# EAGLE design 3MIC_ximpedanceREVB (EAGLE 7.7.0)

## Sheet 1 of 2
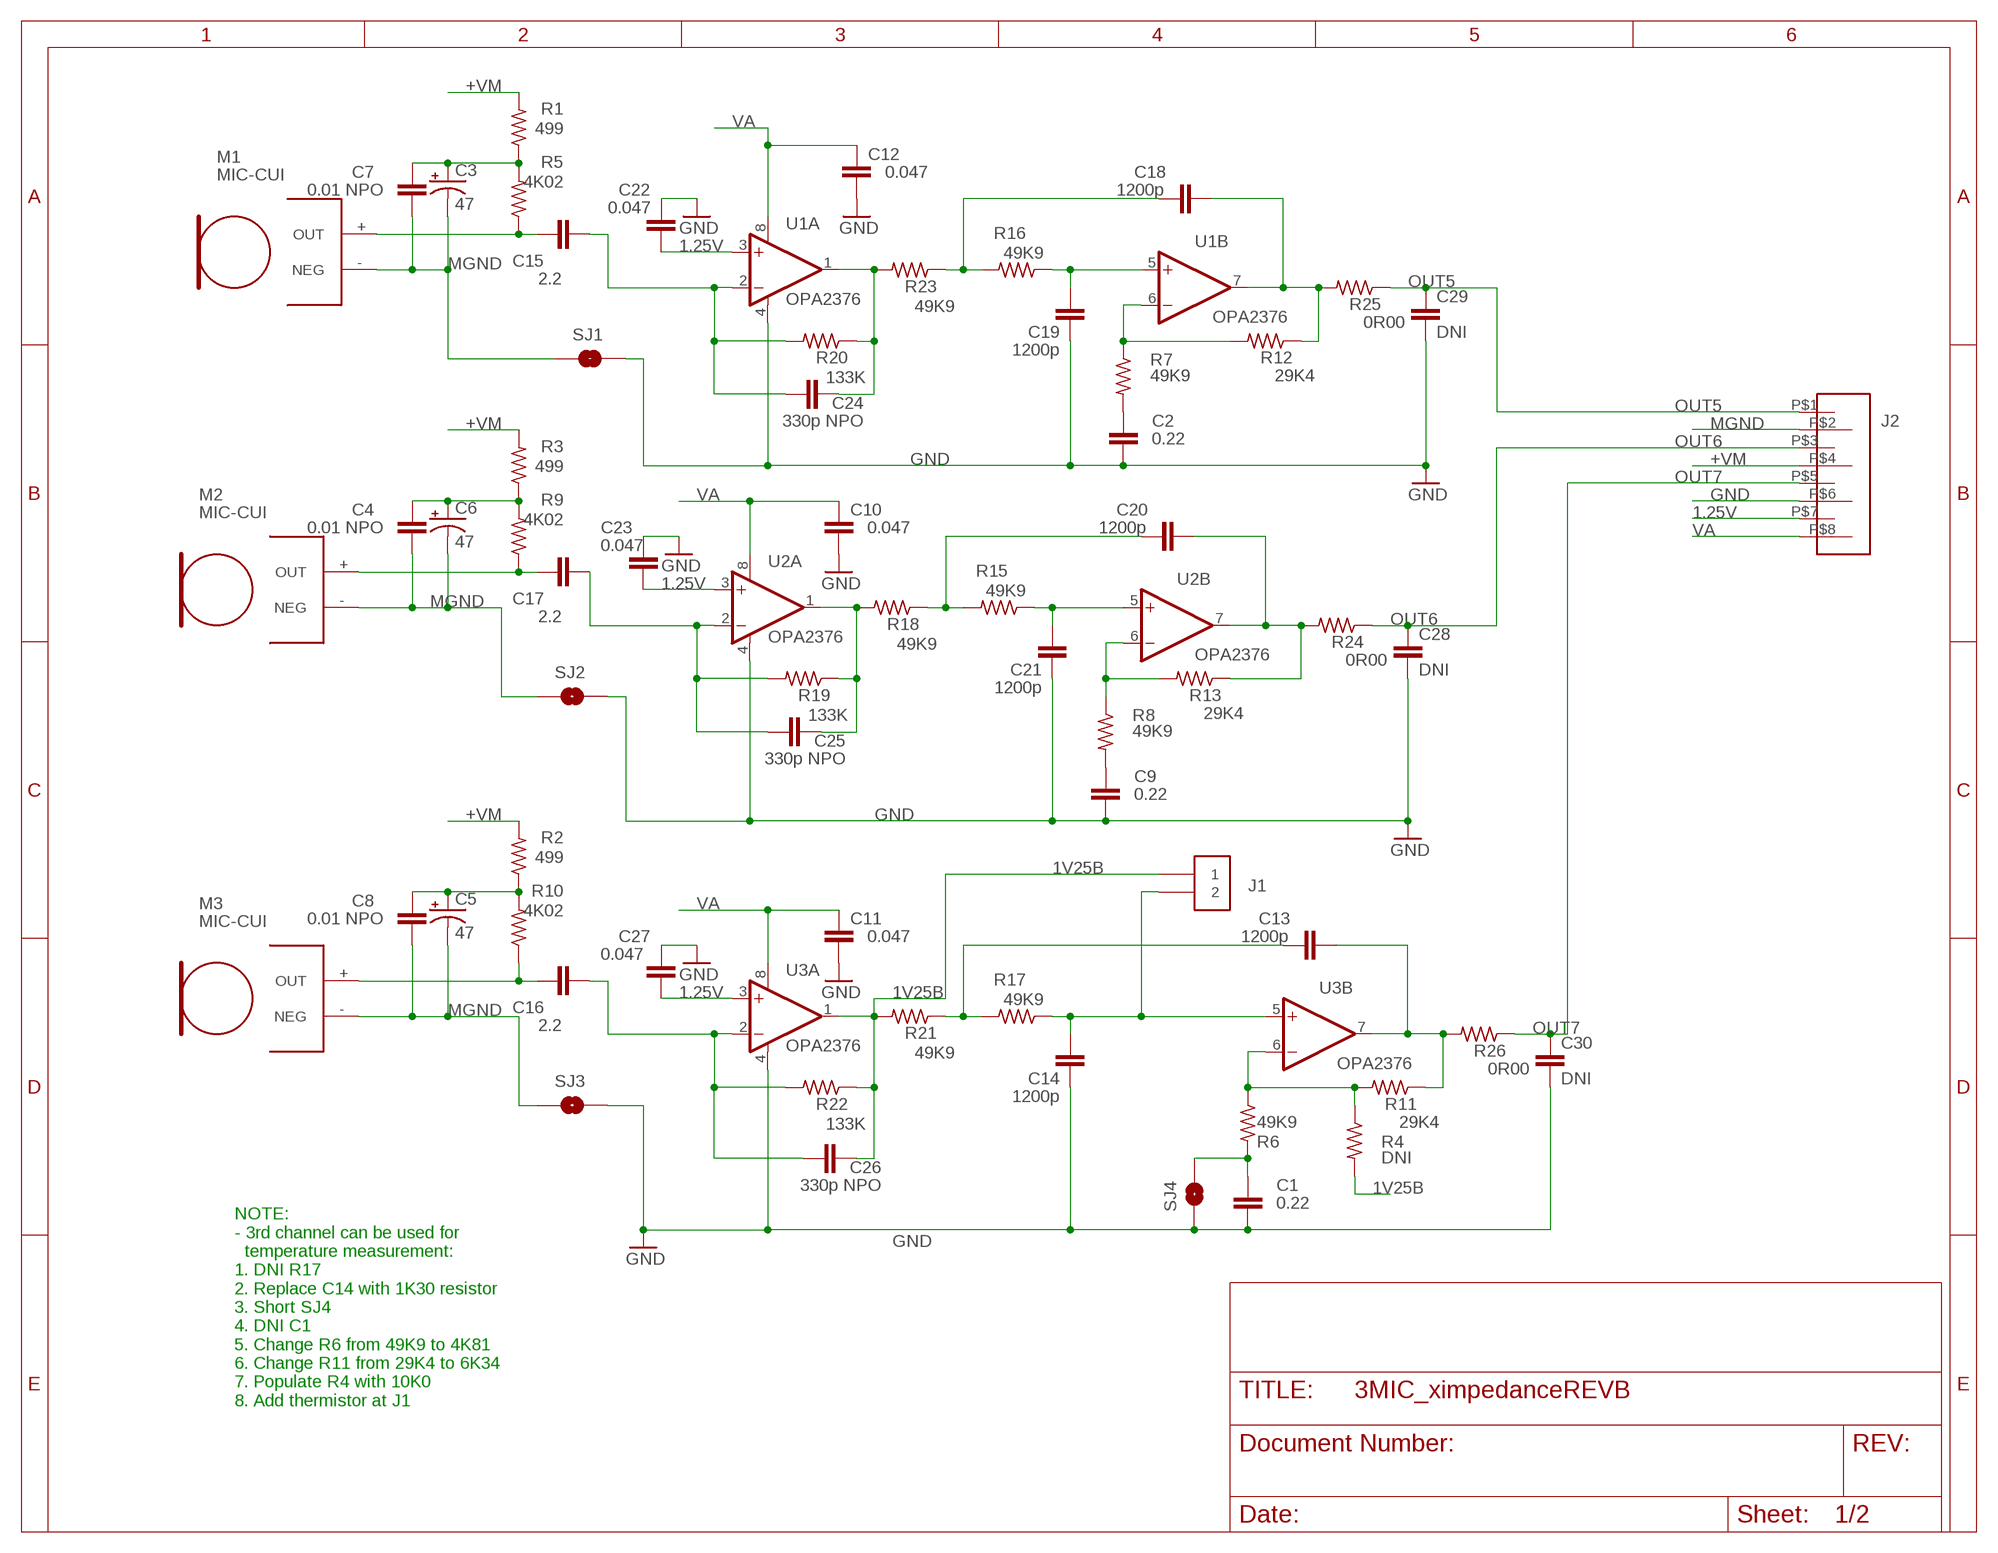
[diagram p0: schematic, sheet 1]

### Parts
C1  0.22  CAPS1206S  [1206S]
C2  0.22  CAPS1206S  [1206S]
C3  47  CAP_POL1206  [EIA3216]
C4  0.01 NPO  CAPS0603S  [0603S]
C5  47  CAP_POL1206  [EIA3216]
C6  47  CAP_POL1206  [EIA3216]
C7  0.01 NPO  CAPS0603S  [0603S]
C8  0.01 NPO  CAPS0603S  [0603S]
C9  0.22  CAPS1206S  [1206S]
C10  0.047  CAPS0805S  [0805S]
C11  0.047  CAPS0805S  [0805S]
C12  0.047  CAPS0805S  [0805S]
C13  1200p  CAPS1206S  [1206S]
C14  1200p  CAPS1206S  [1206S]
C15  2.2  CAPS1210S  [1210S]
C16  2.2  CAPS1210S  [1210S]
C17  2.2  CAPS1210S  [1210S]
C18  1200p  CAPS1206S  [1206S]
C19  1200p  CAPS1206S  [1206S]
C20  1200p  CAPS1206S  [1206S]
C21  1200p  CAPS1206S  [1206S]
C22  0.047  CAPS0805S  [0805S]
C23  0.047  CAPS0805S  [0805S]
C24  330p NPO  CAPS0805S  [0805S]
C25  330p NPO  CAPS0805S  [0805S]
C26  330p NPO  CAPS0805S  [0805S]
C27  0.047  CAPS0805S  [0805S]
C28  DNI  CAPS0603S  [0603S]
C29  DNI  CAPS0603S  [0603S]
C30  DNI  CAPS0603S  [0603S]
J1  CON2TIP-BOT-PADS  [TOP-BOT-PADS]
J2  CON8  [CON8-EDGE]
M1  MIC-CUI  [CUI_EDGE]
M2  MIC-CUI  [CUI_EDGE]
M3  MIC-CUI  [CUI_EDGE]
R1  499  RESISTOR_SM0603S  [0603S]
R2  499  RESISTOR_SM0603S  [0603S]
R3  499  RESISTOR_SM0603S  [0603S]
R4  DNI  RESISTOR_SM0603S  [0603S]
R5  4K02  RESISTOR_SM0603S  [0603S]
R6  49K9  RESISTOR_SM0603S  [0603S]
R7  49K9  RESISTOR_SM0603S  [0603S]
R8  49K9  RESISTOR_SM0603S  [0603S]
R9  4K02  RESISTOR_SM0603S  [0603S]
R10  4K02  RESISTOR_SM0603S  [0603S]
R11  29K4  RESISTOR_SM0603S  [0603S]
R12  29K4  RESISTOR_SM0603S  [0603S]
R13  29K4  RESISTOR_SM0603S  [0603S]
R15  49K9  RESISTOR_SM0603S  [0603S]
R16  49K9  RESISTOR_SM0603S  [0603S]
R17  49K9  RESISTOR_SM0603S  [0603S]
R18  49K9  RESISTOR_SM0603S  [0603S]
R19  133K  RESISTOR_SM0603S  [0603S]
R20  133K  RESISTOR_SM0603S  [0603S]
R21  49K9  RESISTOR_SM0603S  [0603S]
R22  133K  RESISTOR_SM0603S  [0603S]
R23  49K9  RESISTOR_SM0603S  [0603S]
R24  0R00  RESISTOR_SM0603S  [0603S]
R25  0R00  RESISTOR_SM0603S  [0603S]
R26  0R00  RESISTOR_SM0603S  [0603S]
SJ1  SOLDERJUMPERTRACE  [SJ_2S-TRACE]
SJ2  SOLDERJUMPERTRACE  [SJ_2S-TRACE]
SJ3  SOLDERJUMPERTRACE  [SJ_2S-TRACE]
SJ4  SOLDERJUMPERNO  [SJ_2S-NO]
U1  OPA2376  OPA2237E  [MSOP08]
U2  OPA2376  OPA2237E  [MSOP08]
U3  OPA2376  OPA2237E  [MSOP08]

### Nets
1.25V: C22.2 C23.2 C27.2 J2.P$7 U1.3(A:+IN) U2.3(A:+IN) U3.3(A:+IN)
1V25B: C26.1 J1.1 R4.2 R21.2 R22.1 U3.1(A:OUT)
+VM: J2.P$4 R1.2 R2.2 R3.2
GND: C1.1 C2.1 C9.1 C10.1 C11.1 C12.1 C14.1 C19.1 C21.1 C22.1 C23.1 C27.1 C28.2 C29.2 C30.2 J2.P$6 SJ1.2 SJ2.2 SJ3.2 SJ4.1 U1.4(A:V-) U2.4(A:V-) U3.4(A:V-)
M5: C18.1 R12.1 R25.2 U1.7(B:OUT)
M6: C20.1 R13.1 R24.2 U2.7(B:OUT)
M7: C13.1 R11.1 R26.2 U3.7(B:OUT)
MGND: C3.C(-) C4.2 C5.C(-) C6.C(-) C7.2 C8.2 J2.P$2 M1.-(NEG) M2.-(NEG) M3.-(NEG) SJ1.1 SJ2.1 SJ3.1
N$1: C4.1 C6.A(+) R3.1 R9.2
N$3: C5.A(+) C8.1 R2.1 R10.2
N$7: C3.A(+) C7.1 R1.1 R5.2
N$39: C15.2 C24.2 R20.2 U1.2(A:-IN)
N$41: C24.1 R20.1 R23.2 U1.1(A:OUT)
N$42: C18.2 R16.2 R23.1
N$43: C19.2 R16.1 U1.5(B:+IN)
N$44: C2.2 R7.2
N$45: R7.1 R12.2 U1.6(B:-IN)
N$46: C17.1 M2.+(OUT) R9.1
N$48: C17.2 C25.2 R19.2 U2.2(A:-IN)
N$50: C25.1 R18.2 R19.1 U2.1(A:OUT)
N$51: C20.2 R15.2 R18.1
N$52: C21.2 R15.1 U2.5(B:+IN)
N$53: C9.2 R8.2
N$54: R8.1 R13.2 U2.6(B:-IN)
N$55: C16.1 M3.+(OUT) R10.1
N$57: C16.2 C26.2 R22.2 U3.2(A:-IN)
N$60: C13.2 R17.2 R21.1
N$61: C14.2 J1.2 R17.1 U3.5(B:+IN)
N$62: C1.2 R6.2 SJ4.2
N$63: R4.1 R6.1 R11.2 U3.6(B:-IN)
N$90: C15.1 M1.+(OUT) R5.1
OUT5: C29.1 J2.P$1 R25.1
OUT6: C28.1 J2.P$3 R24.1
OUT7: C30.1 J2.P$5 R26.1
VA: C10.2 C11.2 C12.2 J2.P$8 U1.8(A:V+) U2.8(A:V+) U3.8(A:V+)

### Notes on the sheet
- NOTE:
  - 3rd channel can be used for
    temperature measurement:
  1. DNI R17
  2. Replace C14 with 1K30 resistor
  3. Short SJ4
  4. DNI C1
  5. Change R6 from 49K9 to 4K81
  6. Change R11 from 29K4 to 6K34
  7. Populate R4 with 10K0
  8. Add thermistor at J1

## Sheet 2 of 2

## Library data of the parts
C1 C2 C4 C7-C30 = STEVES_BU:CAPS
C3 C5 C6 = SparkFun:CAP_POL: Capacitor Polarized These are standard SMD and PTH capacitors. Normally 10uF, 47uF, and 100uF in electrolytic and tantalum varieties. Always verify the external diameter of the through hole cap, it varies with capacity, voltage, and manufacturer. The EIA devices should be standard.
J1 = STEVES_BU:CON2
J2 = STEVES_BU:CON8
M1-M3 = STEVES_BU:MIC-CUI
R1-R13 R15-R26 = STEVES_BU:RESISTOR_SM
SJ1-SJ3 = SparkFun:SOLDERJUMPER: Solder Jumper Standard SMD solder jumper. Used to automate production. Two varients : Normally Open and Normally Closed are the same, but have different paste layers. NC will have a large amount of paste and should jumper during reflow.
SJ4 = jfrc:SOLDERJUMPER: Solder Jumper Standard SMD solder jumper. Used to automate production. Two varients : Normally Open and Normally Closed are the same, but have different paste layers. NC will have a large amount of paste and should jumper during reflow.
U1-U3 = burr-brown:OPA2237: Single-Supply Operational Amplifiers MicroAmplifier(TM) Series; Product Folder:OPA2237; MF: TEXAS INSTRUMENTS; MPN: OPA2237EA/250; OC_FARNELL: 1470365; OC_NEWARK: 35C1853

## Board
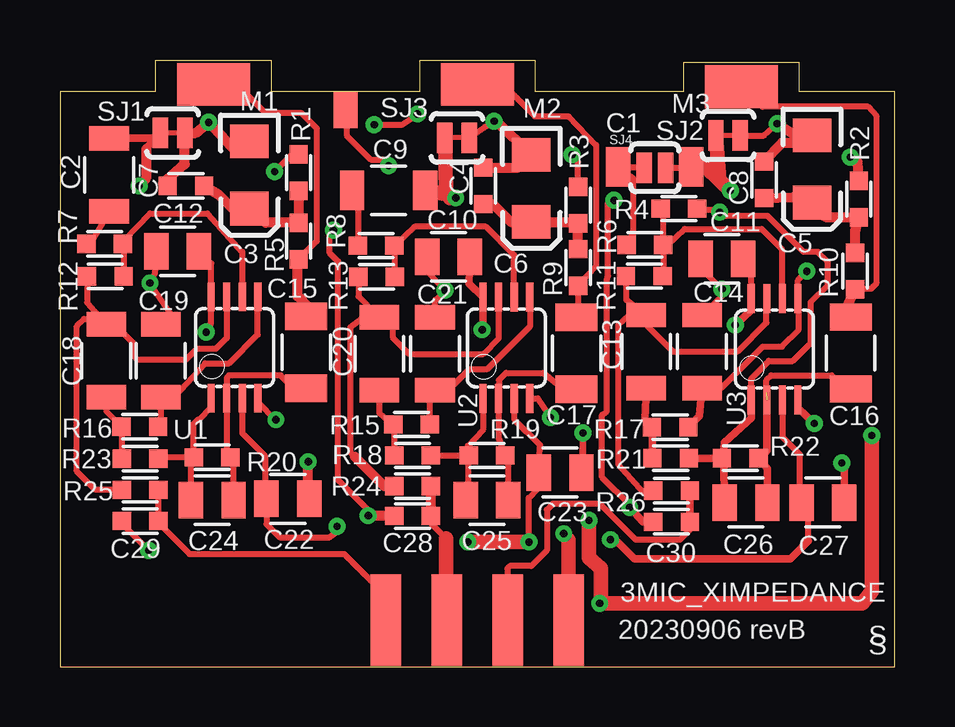
[diagram p1: board, top side]
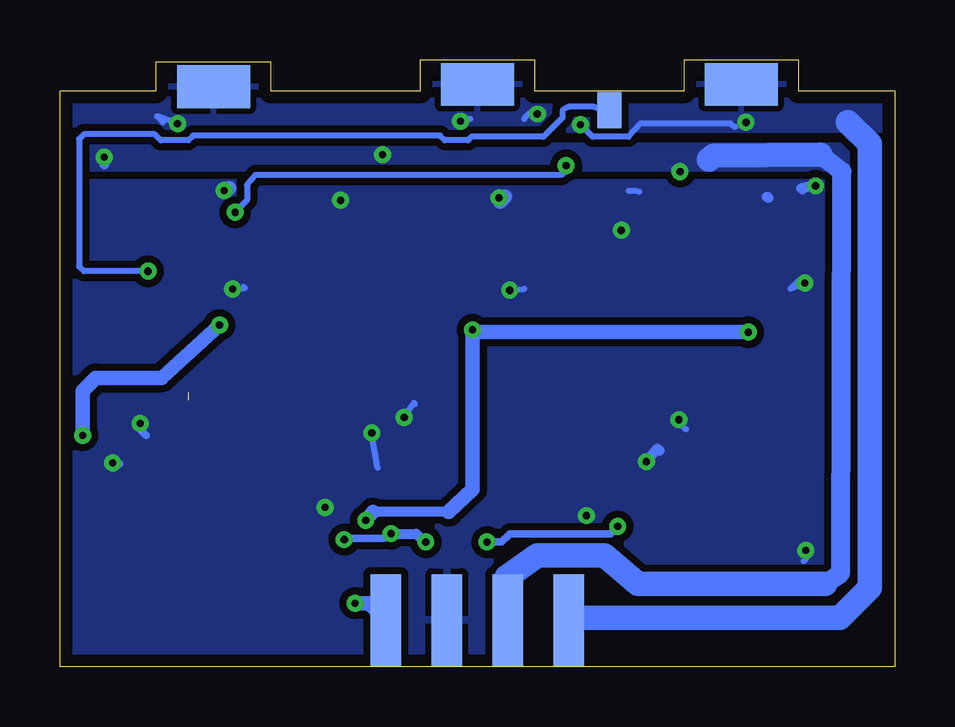
[diagram p2: board, bottom side, seen from below]

Size 34.8 x 25.3 mm. Coordinates in mm from the lower left corner, seen from the top.
Outline: 0,24 4,24 4,25.3 8.8,25.3 8.8,24 15,24 15,25.3 19.8,25.3 19.8,24 26,24 26,25.2 30.8,25.2 30.8,24 34.8,24 34.8,0 0,0 0,24
Copper layers (1*16): Top 0.035mm / dielectric 1.5mm / Bottom 0.035mm
Design rules "default *": minimum track width 8mil, minimum drill 11mil, track to track 8mil, track to pad 8mil, pad to pad 8mil, via to via 8mil, smd to smd 8mil, copper to edge 20mil, drill to drill 8mil, minimum pad ring 10mil, minimum via ring 8mil, stop-mask expansion 4mil, vias tented up to drill 17mil, thermal gap 10mil

### Footprints (pad centres in the part's own frame; a part is rotated, then mirrored left to right if it is on the bottom)
1206S = smd 1.016 x 1.651: 1 -1.524,0; 2 1.524,0
EIA3216 = smd 1.4 x 1.6: A 1.4,0; C -1.4,0
0603S = smd 0.762 x 0.762: 1 -0.762,0; 2 0.762,0
0805S = smd 1.016 x 1.524: 1 -0.889,0; 2 0.889,0
1210S = smd 1.14 x 1.75: 1 -1.5,0; 2 1.5,0
TOP-BOT-PADS = smd 1 x 1.5: 1 0,0 | smd 1 x 1.5 bottom: 2 0,0
CON8-EDGE = smd 3.81 x 1.27: P$1 0,0; P$3 0,-2.54; P$5 0,-5.08; P$7 0,-7.62 | smd 3.81 x 1.27 bottom: P$2 0,0; P$4 0,-2.54; P$6 0,-5.08; P$8 0,-7.62
CUI_EDGE = smd 3.048 x 1.778: + 0,-1.016 | smd 3.048 x 1.778 bottom: - 0,-1.016
SJ_2S-TRACE = smd 0.635 x 1.27: 1 -0.508,0; 2 0.508,0
SJ_2S-NO = smd 0.635 x 1.27: 1 -0.45,0; 2 0.45,0
MSOP08 = smd 0.3 x 1.2: 1 -0.976,-2.113; 2 -0.326,-2.113; 3 0.324,-2.113; 4 0.974,-2.113; 5 0.974,2.112; 6 0.324,2.112; 7 -0.326,2.112; 8 -0.976,2.112

### Placement (x,y rotation side)
C1  24.79,20.84 180 top
C2  2.05,20.51 270 top
C3  7.9,20.5 270 top
C4  17.65,20.05 90 top
C5  31.35,20.75 270 top
C6  19.65,19.95 270 top
C7  5.25,20.05 180 top
C8  29.35,20.3 90 top
C9  13.7,19.87 180 top
C10  16.2,17.09 0 top
C11  27.59,17.01 0 top
C12  4.91,17.32 0 top
C13  24.44,13.14 270 top
C14  26.76,13.14 270 top
C15  10.27,13.11 270 top
C16  32.96,13.08 270 top
C17  21.54,13.07 270 top
C18  1.93,12.76 270 top
C19  4.2,12.76 270 top
C20  13.31,13.05 270 top
C21  15.63,13.05 270 top
C22  9.5,7 180 top
C23  20.85,8.1 180 top
C24  6.35,6.95 0 top
C25  17.8,6.95 0 top
C26  28.6,6.85 0 top
C27  31.8,6.85 180 top
C28  14.7,6.29 180 top
C29  3.34,6.08 180 top
C30  25.5,6.04 180 top
J1  11.9,23.2 0 top
J2  13.59,1.95 90 top
M1  6.4,25.3 0 top
M2  17.4,25.3 0 top
M3  28.4,25.2 0 top
R1  9.95,20.6 90 top
R2  33.3,19.5 90 top
R3  21.6,19.25 90 top
R4  25.8,19.1 0 top
R5  9.95,17.75 90 top
R6  24.39,17.59 180 top
R7  1.87,17.63 180 top
R8  13.18,17.56 180 top
R9  21.6,16.65 90 top
R10  33.15,16.5 90 top
R11  24.36,16.29 0 top
R12  1.89,16.28 0 top
R13  13.2,16.26 0 top
R15  14.66,10.1 180 top
R16  3.33,10.01 180 top
R17  25.44,9.99 180 top
R18  14.7,8.81 0 top
R19  17.8,8.81 0 top
R20  6.34,8.73 0 top
R21  25.46,8.69 0 top
R22  28.36,8.69 0 top
R23  3.34,8.68 0 top
R24  14.7,7.53 180 top
R25  3.34,7.38 180 top
R26  25.5,7.34 180 top
SJ1  4.7,22.25 180 top
SJ2  27.85,22.15 180 top
SJ3  16.55,22.05 180 top
SJ4  24.8,20.8 180 top
U1  7.28,13.31 0 top
U2  18.61,13.3 0 top
U3  29.79,13.24 0 top

### Tracks (layer width: path | path; a pad name or v marks a point on that pad's centre or on a via)
1.25V  (via drill 0.3)
  Top 0.254: U2.3 18.95,11.17 18.95,10.3 20.01,9.24 C23.2 19.95,7.69 19.95,7.45 19.55,7.05 v19.55,5.2 | 31.2,5.25 31.2,6.91 C27.2 | 11.65,5.7 v11.55,5.85 | U1.3 7.6,9.75 8.55,8.8 8.55,7.06 C22.2 8.61,5.94 9.15,5.4 11.25,5.4 11.65,5.7 | 11.6,5.75 11.65,5.7 | J2.P$7 21.21,1.54 21.15,1.6 | 31.15,7.3 30.85,7.3 30.85,8.85 30.11,9.59 U3.3
  Top 0.305: C27.2 31.16,7.29 31.15,7.3 | 21.2,1.65 21.15,1.6 | 31.2,5.25 30.45,4.5 23.95,4.5 23.1,5.35 v22.95,5.3
  Top 0.61: v21,5.55 21.2,5.3 21.2,1.65 | v19.55,5.2 v17,5.2
  Bottom 0.254: 19.65,5.25 v19.55,5.2 | v11.55,5.85 11.6,5.85 11.9,5.55
  Bottom 0.305: v17,5.2 16.4,5.2 16.05,5.55 11.85,5.55 v11.55,5.85 | 23,5.4 v22.95,5.3 22.8,5.3 22.75,5.35 21.3,5.35 v21,5.55
  Bottom 0.406: v21,5.55 19.95,5.55 19.65,5.25
1V25B  (via drill 0.3)
  Top 0.254: J1.1 11.95,22.49 11.95,22.15 12.95,21.15 13.45,21.15 v13.7,20.9 | R4.2 26.61,19.05 27.3,19.05 v27.5,18.95 27.65,18.8 29.5,18.8 31,17.3 31.6,17.3 32,16.9 32,15.9 31.3,15.2 31.3,13.5 30.55,12.75 29.55,12.75 28.81,12.01 U3.1
  Top 0.305: R21.2 R22.1 | C26.1 27.66,8.6 R22.1 | U3.1 28.81,10.36 27.7,9.35 27.65,8.79 R22.1
  Bottom 0.254: v13.7,20.9 13.75,20.65 13.9,20.5 26.65,20.5 27,20.1 27,19.45 v27.5,18.95
+VM  (via drill 0.3)
  Top 0.254: R1.2 9.66,21.36 v8.95,20.65 | R3.2 21.6,21.05 v21.35,21.35
  Top 0.406: R2.2 33.25,21.05 v32.95,21.25
  Bottom 0.254: v8.95,20.65 9.2,20.75 9.15,20.7
  Bottom 0.406: v32.95,21.25 32.95,20.95 | v21.35,21.35 21.35,21.4
  Bottom 0.8: 2.9,3.45 2.25,3.9 2.2,20.65 3.1,21.35
  Bottom 1.016: J2.P$4 16.18,3.72 14.9,4.65 12.1,4.65 10.7,3.45 2.9,3.45 | 3.1,21.35 7.55,21.3 7.75,21.15
  pour Bottom (isolate 0.3, rank 2): 35.9,21.75 -0.9,21.75 -0.8,20.75 35.85,20.75
GND  (via drill 0.3)
  Top 0.254: C21.1 15.63,15.12 15.65,15.3 v16.05,15.7 | v16.05,15.7 15.95,15.7 | C10.1 15.34,16.46 v16.05,15.7 | U2.4 19.91,11.19 v20.45,10.4 | C14.1 27.61,15.46 v27.6,15.75 26.83,16.48 C11.1 | C23.1 21.79,8.54 v21.8,9.75 21.8,8.6 | C22.1 10.39,8.74 10.34,7.51 10.4,8.35 | C19.1 4.8,14.45 v3.75,16 3.95,16.4 C12.1 | U1.4 8.25,11.05 v9,10.3 | C29.2 2.58,5.97 v3.7,4.85 | SJ4.1 26.63,20.8 C1.1 | v23.75,6.65 23.75,6.75 22.6,7.9 22.6,10.5 22.8,10.65 22.8,16.15 22.85,16.3 22.85,19.35 v23.1,19.45 | v12.85,6.3 12.85,6.55 11.6,7.8 11.6,16.9 11.25,17.25 11.25,18.15 v11.4,18.2
  Top 0.305: C27.1 32.69,8.51 v32.6,8.5 | U3.4 30.76,10.79 v31.45,10.15 | C30.2 24.31,6.04 v23.75,6.65 | C2.1 3.98,22.03 SJ1.2 3.95,22.01 3.6,21.6
  Top 0.406: C28.2 13.01,6.29 v12.85,6.3 | 10.34,7.51 v10.35,8.55 | 3.6,21.6 3.59,20.36 v3.3,20.05
  Top 0.61: SJ3.2 16.09,19.71 v16.5,19.55 16.25,19.55 16.27,19.67 C9.1 | C1.1 26.96,20.79 v27.95,19.85 27.49,20.29 SJ2.2
  Bottom 0.254: v16.05,15.7 15.45,15.75 | v20.45,10.4 20.05,11 20,10.95 | v27.6,15.75 27.1,15.8 27.15,15.85 | 21.55,8.3 v21.8,9.75 | 11.1,19.85 10.8,19.85 10.65,19.8 | v3.75,16 4.35,15.75 4,16.1 | v9,10.3 9,10.2 8.7,9.9 | v3.7,4.85 3.7,4.5 3.8,4.4 | v23.1,19.45 23,19.4 23.05,19.35 | v11.4,18.2 11.4,18.25 11.25,18.1
  Bottom 0.305: v32.6,8.5 32.4,8.55 32.3,8.45 | v31.45,10.15 31.45,9.9 31.2,9.65 | v23.75,6.65 23.8,6.6
  Bottom 0.406: v12.85,6.3 12.85,6.2 12.95,6.25 | 5.25,19.55 5.35,19.6 | v10.35,8.55 9.9,9.1 9.8,9 | v3.3,20.05 3.9,19.95 3.85,19.9
  Bottom 0.61: v16.5,19.55 16.25,19.6 16.45,19.4 | 27.9,19.8 v27.95,19.85 27.75,19.95
  pour Bottom (isolate 0.3, rank 3): -2.35,36.65 38.3,36.65 38.3,-1.4 -2.35,-1.4
M5
  Top 0.254: R25.2 1.47,7.38 0.7,8.15 0.7,14.2 1,14.5 1.85,14.5 C18.1 | R12.1 1.13,15.19 C18.1 | U1.7 6.95,13.7 6.5,13.25 5.7,13.25 5.25,12.8 3.41,12.8 3.25,12.8 3.1,12.95 3.1,13.45 2.55,14 2.21,14 C18.1
M6
  Top 0.254: 13.64,14.9 C20.1 | R13.1 12.44,15.45 13.17,14.72 | 13.17,14.72 C20.1 | 13.17,14.72 13.87,14.72 13.87,13.73 14.55,13.05 17.65,13.05 18.3,13.7 18.3,15.4 U2.7 | C20.1 12.67,14.57 12.1,14.15 12.1,8.95 12.3,8.75
  Top 0.406: R24.2 13.52,7.53 12.3,8.75
M7
  Top 0.254: R11.1 23.6,15.31 C13.1 | C13.1 23.71,14.66 23.27,14.25 23.27,8.45 24.35,7.25 24.69,7.3 R26.2 | C13.1 24.39,14.31 25.55,13.15 28.25,13.15 29.45,14.35 29.45,15.49 U3.7
MGND  (via drill 0.3)
  Top 0.254: SJ3.1 17.7,22.5 v18.1,22.75 | SJ2.1 29.35,22.15 v29.9,22.65 | v13.1,22.6 14.25,22.6 v14.9,23.05
  Top 0.406: C5.C 31.45,22.05 31.3,22.1 31.05,22.3 31.3,21.7 | 31.3,21.7 v29.9,22.65 | C8.2 30.11,21.86 30.7,21.85 31.25,21.85 31.3,21.7 | C4.2 19.11,20.81 C6.C 18.15,22.75 v18.1,22.75 | C3.C 8.1,21.4 7.4,21.4 v6.2,22.7 5.65,22.25 SJ1.1 5.2,20.95 4.3,20.16 C7.2
  Bottom 0.254: 6.65,22.5 6.85,22.65 10.6,22.65 11.1,22.1 12.6,22.1 v13.1,22.6 | v18.1,22.75 18.05,22.7 17.7,22.85 | v29.9,22.65 30.75,22.95 30.5,22.7 | v14.9,23.05 14.65,23.15 14.7,23.1 15.2,23.1 15.45,22.85
  Bottom 0.406: v6.2,22.7 6.05,22.75
  Bottom 1.016: 1.95,22.7 1.05,21.8 1.05,3.3 2.3,2.05 13.49,2.05 J2.P$2
  pour Bottom (isolate 0.3): -0.6,28.15 35.75,28.15 35.85,22.4 -0.5,22.4 -0.6,28.1
N$1
  Top 0.406: R9.2 21.6,18.45 | 21.6,18.45 R3.1 | 21.6,18.45 21.5,18.55 C6.A 18.8,18.55 18.06,19.29 C4.1
N$3
  Top 0.406: R10.2 33.15,18.19 R2.1 31.91,18.75 C5.A 30.61,19.59 C8.1
N$7
  Top 0.406: R1.1 R5.2 8.59,18.51 8.56,18.54 C3.A 7.76,19.14 7.16,19.14 6.6,19.7 C7.1
N$39
  Top 0.254: C15.2 9.76,11.59 9.2,12.15 7.05,12.15 6.95,12.05 U1.2 6.95,8.88 R20.2 7.24,8.59 C24.2
N$41
  Top 0.254: U1.1 6.3,10.8 5.8,10.3 5.75,10.3 5.55,10.1 5.55,8.76 R20.1 | C24.1 5.46,8.61 R20.1 | R20.1 4.15,8.73 R23.2
N$42
  Top 0.254: C18.2 1.93,10.65 R16.2 2.57,8.69 R23.1
N$43
  Top 0.254: R16.1 4.2,10.12 C19.2 4.75,11.25 6.05,12.65 7.05,12.65 8.25,13.85 U1.5
N$44
  Top 0.254: C2.2 1.24,17.61 R7.2
N$45
  Top 0.254: 2.83,16.21 R12.2 2.7,17.8 | 2.7,17.8 3.75,18.9 6.15,18.9 7.6,17.3 U1.6 | 2.7,17.8 2.8,17.8 R7.1
N$46
  Top 0.254: M2.+ 17.83,24.35 18.4,24.35 19.8,22.95 21.2,22.95 22.35,21.75 22.35,16.69 R9.1 21.6,14.66 C17.1
N$48
  Top 0.254: C25.2 18.69,8.88 R19.2 18.28,9.54 U2.2 18.3,11.2 18.3,11.95 18.6,12.25 20.15,12.25 20.95,11.6 21.64,11.55 C17.2 21.64,11.81
N$50
  Top 0.254: U2.1 17.65,11.25 17.65,9.9 17.01,9.21 17.01,8.79 | 17.01,8.79 17.01,7.45 C25.1 | R18.2 R19.1 17.01,8.79
N$51
  Top 0.254: R18.1 13.95,8.87 R15.2 13.95,10.1 13.9,10.05 13.31,10.59 C20.2
N$52
  Top 0.254: R15.1 15.42,11.34 C21.2 15.86,11.75 16.4,11.75 17.05,12.4 17.8,12.4 19.58,14.18 U2.5
N$53
  Top 0.254: 12.26,19.55 C9.2 12.45,19.34 12.45,17.7 12.41,17.66 R8.2
N$54
  Top 0.254: R13.2 13.94,16.28 R8.1 14.78,18.35 17.75,18.35 18.93,17.17 U2.6
N$55
  Top 0.254: R10.1 33.16,15.75 33.8,15.75 34.05,16 34.05,22.95 33.7,23.35 29.28,23.35 M3.+
  Top 0.305: M3.+ 29.47,24.18
  Top 0.406: C16.1 32.62,14.56 R10.1
N$57  (1 unrouted)
  Top 0.254: 29.45,11.44 29.45,11.95 29.65,12.15 32.17,12.15 C16.2
  Top 0.305: C26.2 29.49,8.27 R22.2 29.46,9 U3.2 | C16.2 32.44,11.51
N$60
  Top 0.305: C13.2 24.39,10.33 R17.2 24.7,9.97 R21.1
N$61  (via drill 0.3)
  Top 0.254: C14.2 26.65,11.63 27.58,11.63 29.3,13.35 30.1,13.35 30.8,14.05 30.8,15.44 U3.5 30.76,16.11 v31.13,16.49
  Top 0.305: C14.2 26.66,10.45 R17.1
  Bottom 0.254: J1.2 12.3,23.2 12.55,23.35 13.6,23.35 13.85,23.2 13.85,22.9 14.65,22.1 17.65,22.1 17.8,21.95 18.75,21.95 18.95,22.15 29.25,22.15 29.45,21.95 30.6,21.95 30.85,22.2 33.8,22.2 34,22 34,16.69 33.79,16.49 v31.13,16.49
N$62
  Top 0.254: R6.2 23.85,17.59 23.85,18.05 23.9,18.05 23.9,20.35 C1.2 23.65,20.8 SJ4.2
N$63
  Top 0.254: R6.1 25.15,16.21 R11.2 | R6.1 25.15,18.99 R4.1 | R6.1 25.34,17.59 26.05,18.25 29.25,18.25 30.11,17.39 U3.6
N$90
  Top 0.254: M1.+ 7.37,24.28 8.55,23.1 10.05,23.1 10.7,22.45 10.7,17.74 R5.1
  Top 0.406: C15.1 10.37,14.98 9.9,15.45 9.9,16.94 R5.1
OUT5
  Top 0.254: 13.65,2.9 11.85,4.7 5.4,4.7 4.11,5.99 C29.1 R25.1 | 13.65,2.01 J2.P$1
  Top 0.61: 13.65,2.9 13.65,2.01
OUT6
  Top 0.254: C28.1 15.46,5.99 16.1,5.35 | 16.1,1.98 J2.P$3
  Top 0.406: R24.1 C28.1
  Top 0.61: 16.1,5.35 16.1,1.98
OUT7
  Top 0.254: C30.1 26.26,5.71 25.85,5.3 24,5.3 22.5,6.8 20.55,6.8 20.3,6.55 20.3,4.85 19.65,4.2 18.75,4.2 18.65,4.1 18.65,3.3 18.6,3.25 18.6,2.02 J2.P$5
  Top 0.305: R26.1 C30.1
VA  (via drill 0.3)
  Top 0.254: v6.1,13.95 6.05,14.1 6.3,14.3 U1.8 6.3,16.81 C12.2 | v17.6,14.05 17.65,14.05 | C11.2 28.8,16.61 U3.8
  Top 0.305: C10.2 17.06,15.98 U2.8 17.63,14.08 v17.6,14.05 | 28.15,14.4 v28.15,14.25 28.81,14.86 U3.8
  Top 0.61: v33.85,9.65 33.85,3.15 33.45,2.65 v22.5,2.65 22.55,2.8 22.55,4.1 22.05,4.55 v22.05,6.1
  Bottom 0.406: 18.6,6.45 21.75,6.45
  Bottom 0.61: v28.15,14.25 30.55,12.05 33.3,12.05 33.85,11.5 v33.85,9.65 | 18.6,6.45 17.6,7.4 v17.6,14.05 17.5,13.95 v6.1,13.95 | 21.75,6.45 v22.05,6.1 | v22.5,2.65 21.91,2.65 J2.P$8

### Text on the board
tPlace: 3MIC_XIMPEDANCE | 20230906 revB | S | S